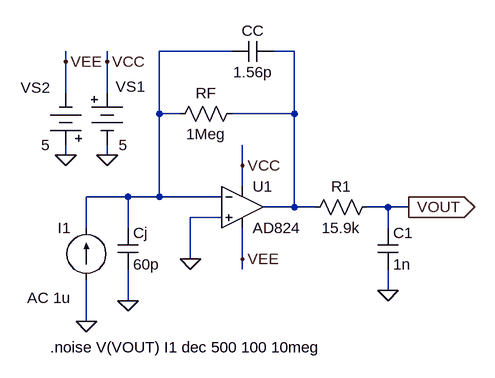
[diagram p0: schematic fig-03-03-29.asc]
fig-03-03-29.asc, the LTspice schematic file:
Version 4
SHEET 1 880 680
WIRE 192 -64 80 -64
WIRE 288 -64 256 -64
WIRE -64 -48 -64 -64
WIRE 0 -48 0 -64
WIRE -64 0 -64 -48
WIRE 0 0 0 -48
WIRE 80 32 80 -64
WIRE 112 32 80 32
WIRE 288 32 288 -64
WIRE 288 32 192 32
WIRE -64 96 -64 80
WIRE 0 96 0 80
WIRE 208 112 208 80
WIRE 208 144 208 112
WIRE 32 160 -32 160
WIRE 80 160 80 32
WIRE 80 160 32 160
WIRE 176 160 80 160
WIRE 288 176 288 32
WIRE 288 176 240 176
WIRE 320 176 288 176
WIRE 432 176 400 176
WIRE 464 176 432 176
WIRE 176 192 128 192
WIRE -32 208 -32 160
WIRE 32 208 32 160
WIRE 432 208 432 176
WIRE 128 256 128 192
WIRE 208 256 208 208
WIRE 208 272 208 256
WIRE 432 304 432 272
WIRE 32 320 32 272
WIRE -32 352 -32 288
FLAG 128 256 0
FLAG -32 352 0
FLAG 464 176 VOUT
IOPIN 464 176 Out
FLAG -64 96 0
FLAG 0 96 0
FLAG -64 -48 VEE
FLAG 0 -48 VCC
FLAG 208 112 VCC
FLAG 208 256 VEE
FLAG 32 320 0
FLAG 432 304 0
SYMBOL res 208 16 R90
WINDOW 0 0 56 VBottom 2
WINDOW 3 32 56 VTop 2
SYMATTR InstName RF
SYMATTR Value 1Meg
SYMBOL Misc\\battery 0 -16 R0
WINDOW 0 13 6 Left 2
WINDOW 3 18 96 Left 2
WINDOW 123 0 0 Left 0
WINDOW 39 0 0 Left 0
SYMATTR InstName VS1
SYMATTR Value 5
SYMBOL Misc\\battery -64 96 R180
WINDOW 0 24 104 Left 2
WINDOW 3 24 16 Left 2
WINDOW 123 0 0 Left 0
WINDOW 39 0 0 Left 0
SYMATTR InstName VS2
SYMATTR Value 5
SYMBOL Opamps\\AD824 208 112 R0
SYMATTR InstName U1
SYMBOL cap 16 208 R0
SYMATTR InstName Cj
SYMATTR Value 60p
SYMBOL current -32 288 R180
WINDOW 0 24 80 Left 2
WINDOW 3 24 0 Left 2
WINDOW 123 24 -28 Left 2
WINDOW 39 0 0 Left 0
SYMATTR InstName I1
SYMATTR Value ""
SYMATTR Value2 AC 1u
SYMBOL cap 256 -80 R90
WINDOW 0 0 32 VBottom 2
WINDOW 3 32 32 VTop 2
SYMATTR InstName CC
SYMATTR Value 1.56p
SYMBOL res 416 160 R90
WINDOW 0 0 56 VBottom 2
WINDOW 3 32 56 VTop 2
SYMATTR InstName R1
SYMATTR Value 15.9k
SYMBOL cap 416 208 R0
SYMATTR InstName C1
SYMATTR Value 1n
TEXT -88 392 Left 2 !.noise V(VOUT) I1 dec 500 100 10meg

The netlist it stands for:
* fig-03-03-29.asc
RF N002 N001 1Meg
VS1 VCC 0 5
VS2 0 VEE 5
XU1 0 N001 VCC VEE N002 AD824  ; pins In+ In- V+ V- OUT
Cj N001 0 60p
I1 0 N001 AC 1u
CC N002 N001 1.56p
R1 VOUT N002 15.9k
C1 VOUT 0 1n
.noise V(VOUT) I1 dec 500 100 10meg
.backanno
.end